# Altium schematic sheet Power.SchDoc
size A; SheetNumber: 3; SheetTotal: 4
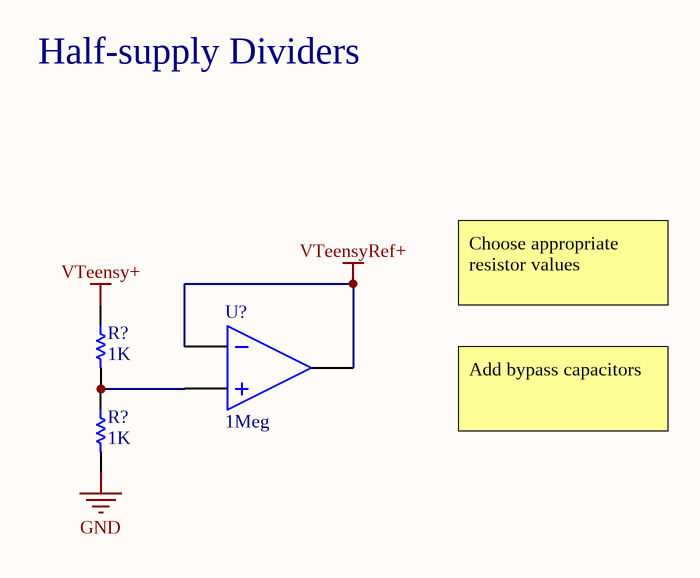
[diagram p0: Power.SchDoc]

## Parts
(Parts that share a designator on the sheet are numbered #1, #2 ... from top to bottom, then left to right.)
R?#1  value 1K  (hidden comment: Resistor)
R?#2  value 1K  (hidden comment: Resistor)
U?  GAIN: 1Meg  (hidden comment: Ideal Operational Amplifier)

## Nets
GND: R?#2.2
VTeensy+: R?#1.1
VTeensyRef+: U?.1(IN-) U?.3(OUT)
NetR?#1_2: R?#1.2 R?#2.1 U?.2(IN+)

## Notes on the sheet
- Half-supply Dividers
- Choose appropriate resistor values
- Add bypass capacitors

## Library data of the parts
R?#1 R?#2 = Resistor: TC1: 0; SimulationGenericComponent: True; TC2: 0
U? = OpAmp: SimulationGenericComponent: True